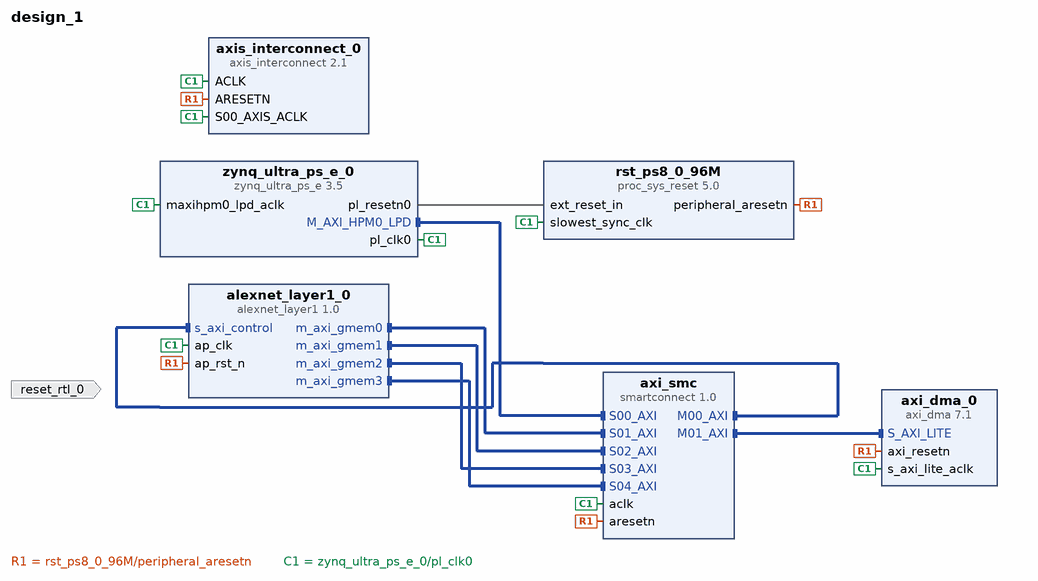
[diagram p0: block diagram of the top level]
# Vivado block design design_1, xczu7ev-ffvc1156-2-e, Vivado 2025.1
create_bd_design design_1

create_bd_port -dir I -type rst reset_rtl_0
set_property -dict {CONFIG.POLARITY ACTIVE_HIGH} [get_bd_ports reset_rtl_0]

create_bd_cell -type ip -vlnv xilinx.com:ip:zynq_ultra_ps_e:3.5 zynq_ultra_ps_e_0
set_property -dict {CONFIG.PSU__DDR_HIGH_ADDRESS_GUI_ENABLE 0 CONFIG.PSU__FPGA_PL1_ENABLE 1} [get_bd_cells zynq_ultra_ps_e_0]
# 31 more settings of zynq_ultra_ps_e_0 are not shown: defaults, MIO pin electricals, DDR timing, and values the tool derives
create_bd_cell -type ip -vlnv xilinx.com:hls:alexnet_layer1:1.0 alexnet_layer1_0
create_bd_cell -type ip -vlnv xilinx.com:ip:axis_interconnect:2.1 axis_interconnect_0
create_bd_cell -type ip -vlnv xilinx.com:ip:smartconnect:1.0 axi_smc
set_property -dict {CONFIG.NUM_MI 2 CONFIG.NUM_SI 5} [get_bd_cells axi_smc]
create_bd_cell -type ip -vlnv xilinx.com:ip:proc_sys_reset:5.0 rst_ps8_0_96M
create_bd_cell -type ip -vlnv xilinx.com:ip:axi_dma:7.1 axi_dma_0

# ---- connections ----

connect_bd_intf_net [get_bd_intf_pins alexnet_layer1_0/m_axi_gmem0] [get_bd_intf_pins axi_smc/S01_AXI]
connect_bd_intf_net [get_bd_intf_pins alexnet_layer1_0/m_axi_gmem1] [get_bd_intf_pins axi_smc/S02_AXI]
connect_bd_intf_net [get_bd_intf_pins alexnet_layer1_0/m_axi_gmem2] [get_bd_intf_pins axi_smc/S03_AXI]
connect_bd_intf_net [get_bd_intf_pins alexnet_layer1_0/m_axi_gmem3] [get_bd_intf_pins axi_smc/S04_AXI]
connect_bd_intf_net [get_bd_intf_pins axi_smc/M00_AXI] [get_bd_intf_pins alexnet_layer1_0/s_axi_control]
connect_bd_intf_net [get_bd_intf_pins axi_smc/M01_AXI] [get_bd_intf_pins axi_dma_0/S_AXI_LITE]
connect_bd_intf_net [get_bd_intf_pins zynq_ultra_ps_e_0/M_AXI_HPM0_LPD] [get_bd_intf_pins axi_smc/S00_AXI]
connect_bd_net [get_bd_pins rst_ps8_0_96M/peripheral_aresetn] \
  [get_bd_pins alexnet_layer1_0/ap_rst_n] [get_bd_pins axi_smc/aresetn] [get_bd_pins axis_interconnect_0/ARESETN] \
  [get_bd_pins axi_dma_0/axi_resetn]
connect_bd_net [get_bd_pins zynq_ultra_ps_e_0/pl_clk0] \
  [get_bd_pins zynq_ultra_ps_e_0/maxihpm0_lpd_aclk] [get_bd_pins axi_smc/aclk] [get_bd_pins alexnet_layer1_0/ap_clk] \
  [get_bd_pins rst_ps8_0_96M/slowest_sync_clk] [get_bd_pins axis_interconnect_0/ACLK] [get_bd_pins axi_dma_0/s_axi_lite_aclk] \
  [get_bd_pins axis_interconnect_0/S00_AXIS_ACLK]
connect_bd_net [get_bd_pins zynq_ultra_ps_e_0/pl_resetn0] [get_bd_pins rst_ps8_0_96M/ext_reset_in]

# ---- address map ----
exclude_bd_addr_seg -offset 0x0000000080000000 -range 64K -target_address_space [get_bd_addr_spaces alexnet_layer1_0/Data_m_axi_gmem0] [get_bd_addr_segs alexnet_layer1_0/s_axi_control/Reg]
exclude_bd_addr_seg -offset 0x0000000080010000 -range 64K -target_address_space [get_bd_addr_spaces alexnet_layer1_0/Data_m_axi_gmem0] [get_bd_addr_segs axi_dma_0/S_AXI_LITE/Reg]
exclude_bd_addr_seg -offset 0x0000000080000000 -range 64K -target_address_space [get_bd_addr_spaces alexnet_layer1_0/Data_m_axi_gmem1] [get_bd_addr_segs alexnet_layer1_0/s_axi_control/Reg]
exclude_bd_addr_seg -offset 0x0000000080010000 -range 64K -target_address_space [get_bd_addr_spaces alexnet_layer1_0/Data_m_axi_gmem1] [get_bd_addr_segs axi_dma_0/S_AXI_LITE/Reg]
exclude_bd_addr_seg -offset 0x0000000080000000 -range 64K -target_address_space [get_bd_addr_spaces alexnet_layer1_0/Data_m_axi_gmem2] [get_bd_addr_segs alexnet_layer1_0/s_axi_control/Reg]
exclude_bd_addr_seg -offset 0x0000000080010000 -range 64K -target_address_space [get_bd_addr_spaces alexnet_layer1_0/Data_m_axi_gmem2] [get_bd_addr_segs axi_dma_0/S_AXI_LITE/Reg]
exclude_bd_addr_seg -offset 0x0000000080000000 -range 64K -target_address_space [get_bd_addr_spaces alexnet_layer1_0/Data_m_axi_gmem3] [get_bd_addr_segs alexnet_layer1_0/s_axi_control/Reg]
exclude_bd_addr_seg -offset 0x0000000080010000 -range 64K -target_address_space [get_bd_addr_spaces alexnet_layer1_0/Data_m_axi_gmem3] [get_bd_addr_segs axi_dma_0/S_AXI_LITE/Reg]
assign_bd_address -offset 0x0080000000 -range 64K -target_address_space [get_bd_addr_spaces zynq_ultra_ps_e_0/Data] [get_bd_addr_segs alexnet_layer1_0/s_axi_control/Reg]
assign_bd_address -offset 0x0080010000 -range 64K -target_address_space [get_bd_addr_spaces zynq_ultra_ps_e_0/Data] [get_bd_addr_segs axi_dma_0/S_AXI_LITE/Reg]

validate_bd_design
save_bd_design
